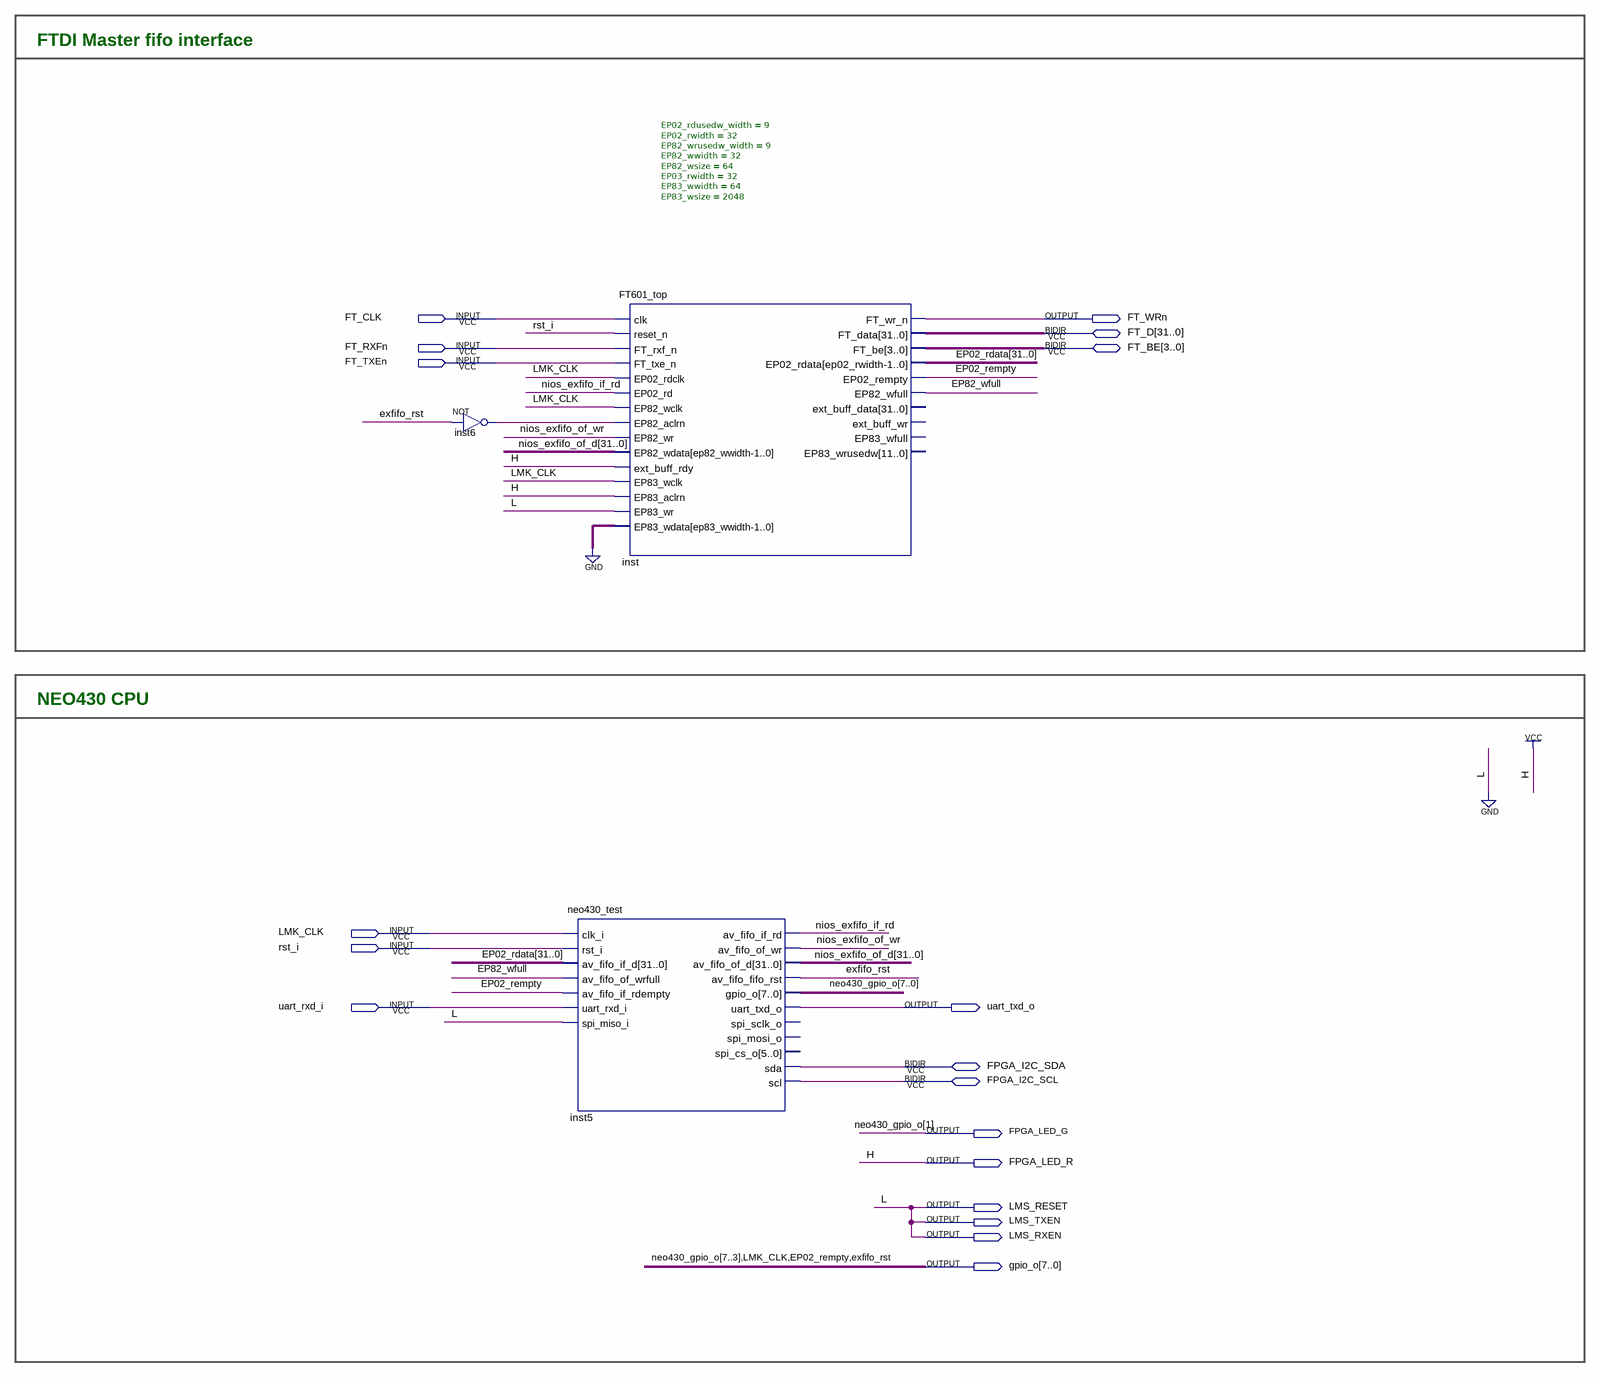
[diagram p0: schematic sheet]
// Quartus schematic limesdr-mini_factory_top.bdf as structural Verilog: 3 symbols, 18 pins
module \limesdr-mini_factory_top  (
  input  FT_CLK,
  input  FT_RXFn,
  input  FT_TXEn,
  input  LMK_CLK,
  input  rst_i,
  input  uart_rxd_i,
  inout  [31:0] FT_D,
  inout  [3:0] FT_BE,
  inout  FPGA_I2C_SDA,
  inout  FPGA_I2C_SCL,
  output FT_WRn,
  output uart_txd_o,
  output FPGA_LED_G,
  output FPGA_LED_R,
  output LMS_RESET,
  output LMS_TXEN,
  output LMS_RXEN,
  output [7:0] gpio_o
);

  wire EP82_wfull, inst6_out, nios_exfifo_if_rd, nios_exfifo_of_wr;
  wire [2:0] neo430_gpio_o;
  wire [31:0] EP02_rdata, nios_exfifo_of_d;

  not inst6 (inst6_out, gpio_o[0]);
  neo430_test inst5 (
    .clk_i(LMK_CLK), .rst_i(rst_i), .av_fifo_if_d(EP02_rdata), .av_fifo_of_wrfull(EP82_wfull),
    .av_fifo_if_rdempty(gpio_o[1]), .uart_rxd_i(uart_rxd_i), .spi_miso_i(1'b0),
    .av_fifo_if_rd(nios_exfifo_if_rd), .av_fifo_of_wr(nios_exfifo_of_wr), .av_fifo_of_d(nios_exfifo_of_d),
    .av_fifo_fifo_rst(gpio_o[0]), .gpio_o({gpio_o[7:3], neo430_gpio_o[2], FPGA_LED_G, neo430_gpio_o[0]}),
    .uart_txd_o(uart_txd_o), .sda(FPGA_I2C_SDA), .scl(FPGA_I2C_SCL));  // open: spi_sclk_o, spi_mosi_o, spi_cs_o
  FT601_top #(.EP02_rdusedw_width(9), .EP02_rwidth(32), .EP82_wrusedw_width(9), .EP82_wwidth(32), .EP82_wsize(64), .EP03_rwidth(32), .EP83_wwidth(64), .EP83_wsize(2048)) inst (
    .clk(FT_CLK), .reset_n(rst_i), .FT_rxf_n(FT_RXFn), .FT_txe_n(FT_TXEn), .EP02_rdclk(LMK_CLK),
    .EP02_rd(nios_exfifo_if_rd), .EP82_wclk(LMK_CLK), .EP82_aclrn(inst6_out), .EP82_wr(nios_exfifo_of_wr),
    .EP82_wdata(nios_exfifo_of_d), .ext_buff_rdy(1'b1), .EP83_wclk(LMK_CLK), .EP83_aclrn(1'b1),
    .EP83_wr(1'b0), .EP83_wdata({64{1'b0}}), .FT_wr_n(FT_WRn), .EP02_rdata(EP02_rdata),
    .EP02_rempty(gpio_o[1]), .EP82_wfull(EP82_wfull), .FT_data(FT_D), .FT_be(FT_BE));  // open: ext_buff_data, ext_buff_wr, EP83_wfull, EP83_wrusedw

  assign FPGA_LED_R = 1'b1;
  assign gpio_o[2] = LMK_CLK;
  assign LMS_RESET = 1'b0;
  assign LMS_RXEN = 1'b0;
  assign LMS_TXEN = 1'b0;

  // Other names for the same wires on the sheet: EP02_rempty = gpio_o[1]; exfifo_rst = gpio_o[0];
  //   neo430_gpio_o (some bits) = {gpio_o[7:3], FPGA_LED_G}

  // Notes on the sheet:
  //   FTDI Master fifo interface
  //   NEO430 CPU
endmodule
